# Altium project COOP4453_BerkantAy.PrjPcb
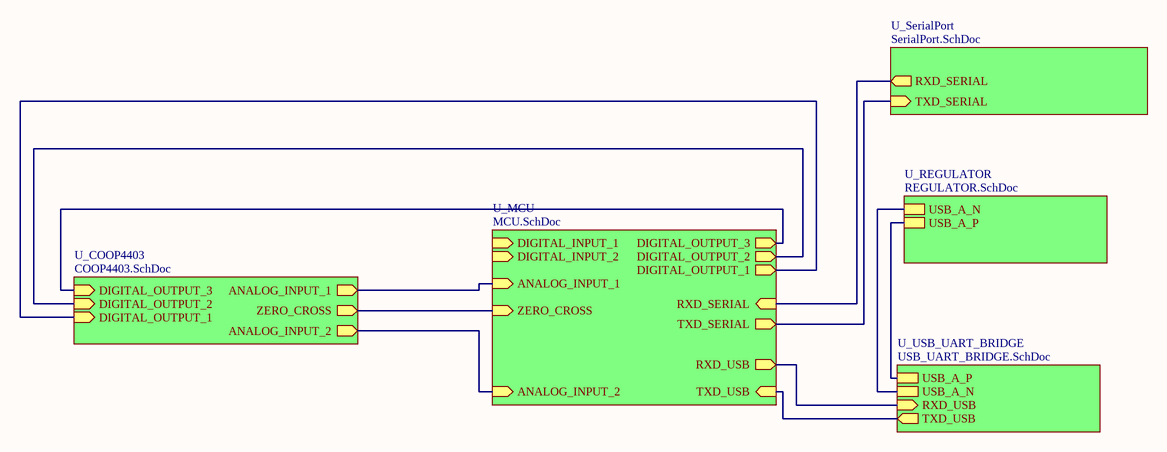
[diagram p0: MAINSCHEMATIC.SchDoc]
6 sheets, 104 parts. Net scope: hierarchical (ports join the sheet entries above them; power ports are global).
Board files: COOP4403_V2.PcbDoc, COOP4403.PcbDoc
Sheets:
  MAINSCHEMATIC.SchDoc
    U_COOP4403 = COOP4403.SchDoc
    U_MCU = MCU.SchDoc
    U_REGULATOR = REGULATOR.SchDoc
    U_SerialPort = SerialPort.SchDoc
    U_USB_UART_BRIDGE = USB_UART_BRIDGE.SchDoc

## Sheet MAINSCHEMATIC.SchDoc
size A

### Sub-sheets
U_COOP4403 = COOP4403.SchDoc: ANALOG_INPUT_2 (out), ANALOG_INPUT_1 (out), DIGITAL_OUTPUT_2 (in), DIGITAL_OUTPUT_1 (in), DIGITAL_OUTPUT_3 (in), ZERO_CROSS (out)
U_MCU = MCU.SchDoc: DIGITAL_OUTPUT_3 (out), DIGITAL_OUTPUT_2 (out), DIGITAL_OUTPUT_1 (out), DIGITAL_INPUT_1 (in), DIGITAL_INPUT_2 (in), RXD_USB (out), TXD_USB (in), ANALOG_INPUT_1 (in), ANALOG_INPUT_2 (in), ZERO_CROSS (in), TXD_SERIAL (out), RXD_SERIAL (in)
U_REGULATOR = REGULATOR.SchDoc: USB_A_N, USB_A_P
U_SerialPort = SerialPort.SchDoc: RXD_SERIAL (out), TXD_SERIAL (in)
U_USB_UART_BRIDGE = USB_UART_BRIDGE.SchDoc: USB_A_N, USB_A_P, TXD_USB (out), RXD_USB (in)

### Nets
RXD_A_N: sheet U_MCU/TXD_SERIAL, sheet U_SerialPort/TXD_SERIAL
RXD_A_P: sheet U_MCU/RXD_SERIAL, sheet U_SerialPort/RXD_SERIAL
USB_A_N: sheet U_REGULATOR/USB_A_N, sheet U_USB_UART_BRIDGE/USB_A_N
USB_A_P: sheet U_REGULATOR/USB_A_P, sheet U_USB_UART_BRIDGE/USB_A_P
USB_B_N: sheet U_MCU/TXD_USB, sheet U_USB_UART_BRIDGE/TXD_USB
USB_B_P: sheet U_MCU/RXD_USB, sheet U_USB_UART_BRIDGE/RXD_USB
NetC5_2: sheet U_COOP4403/ANALOG_INPUT_2, sheet U_MCU/ANALOG_INPUT_2
NetC7_2: sheet U_COOP4403/ANALOG_INPUT_1, sheet U_MCU/ANALOG_INPUT_1
NetIC2_1: sheet U_COOP4403/ZERO_CROSS, sheet U_MCU/ZERO_CROSS
NetIC4_9: sheet U_COOP4403/DIGITAL_OUTPUT_3, sheet U_MCU/DIGITAL_OUTPUT_3
NetIC4_10: sheet U_COOP4403/DIGITAL_OUTPUT_2, sheet U_MCU/DIGITAL_OUTPUT_2
NetIC4_11: sheet U_COOP4403/DIGITAL_OUTPUT_1, sheet U_MCU/DIGITAL_OUTPUT_1

## Sheet COOP4403.SchDoc
size A3
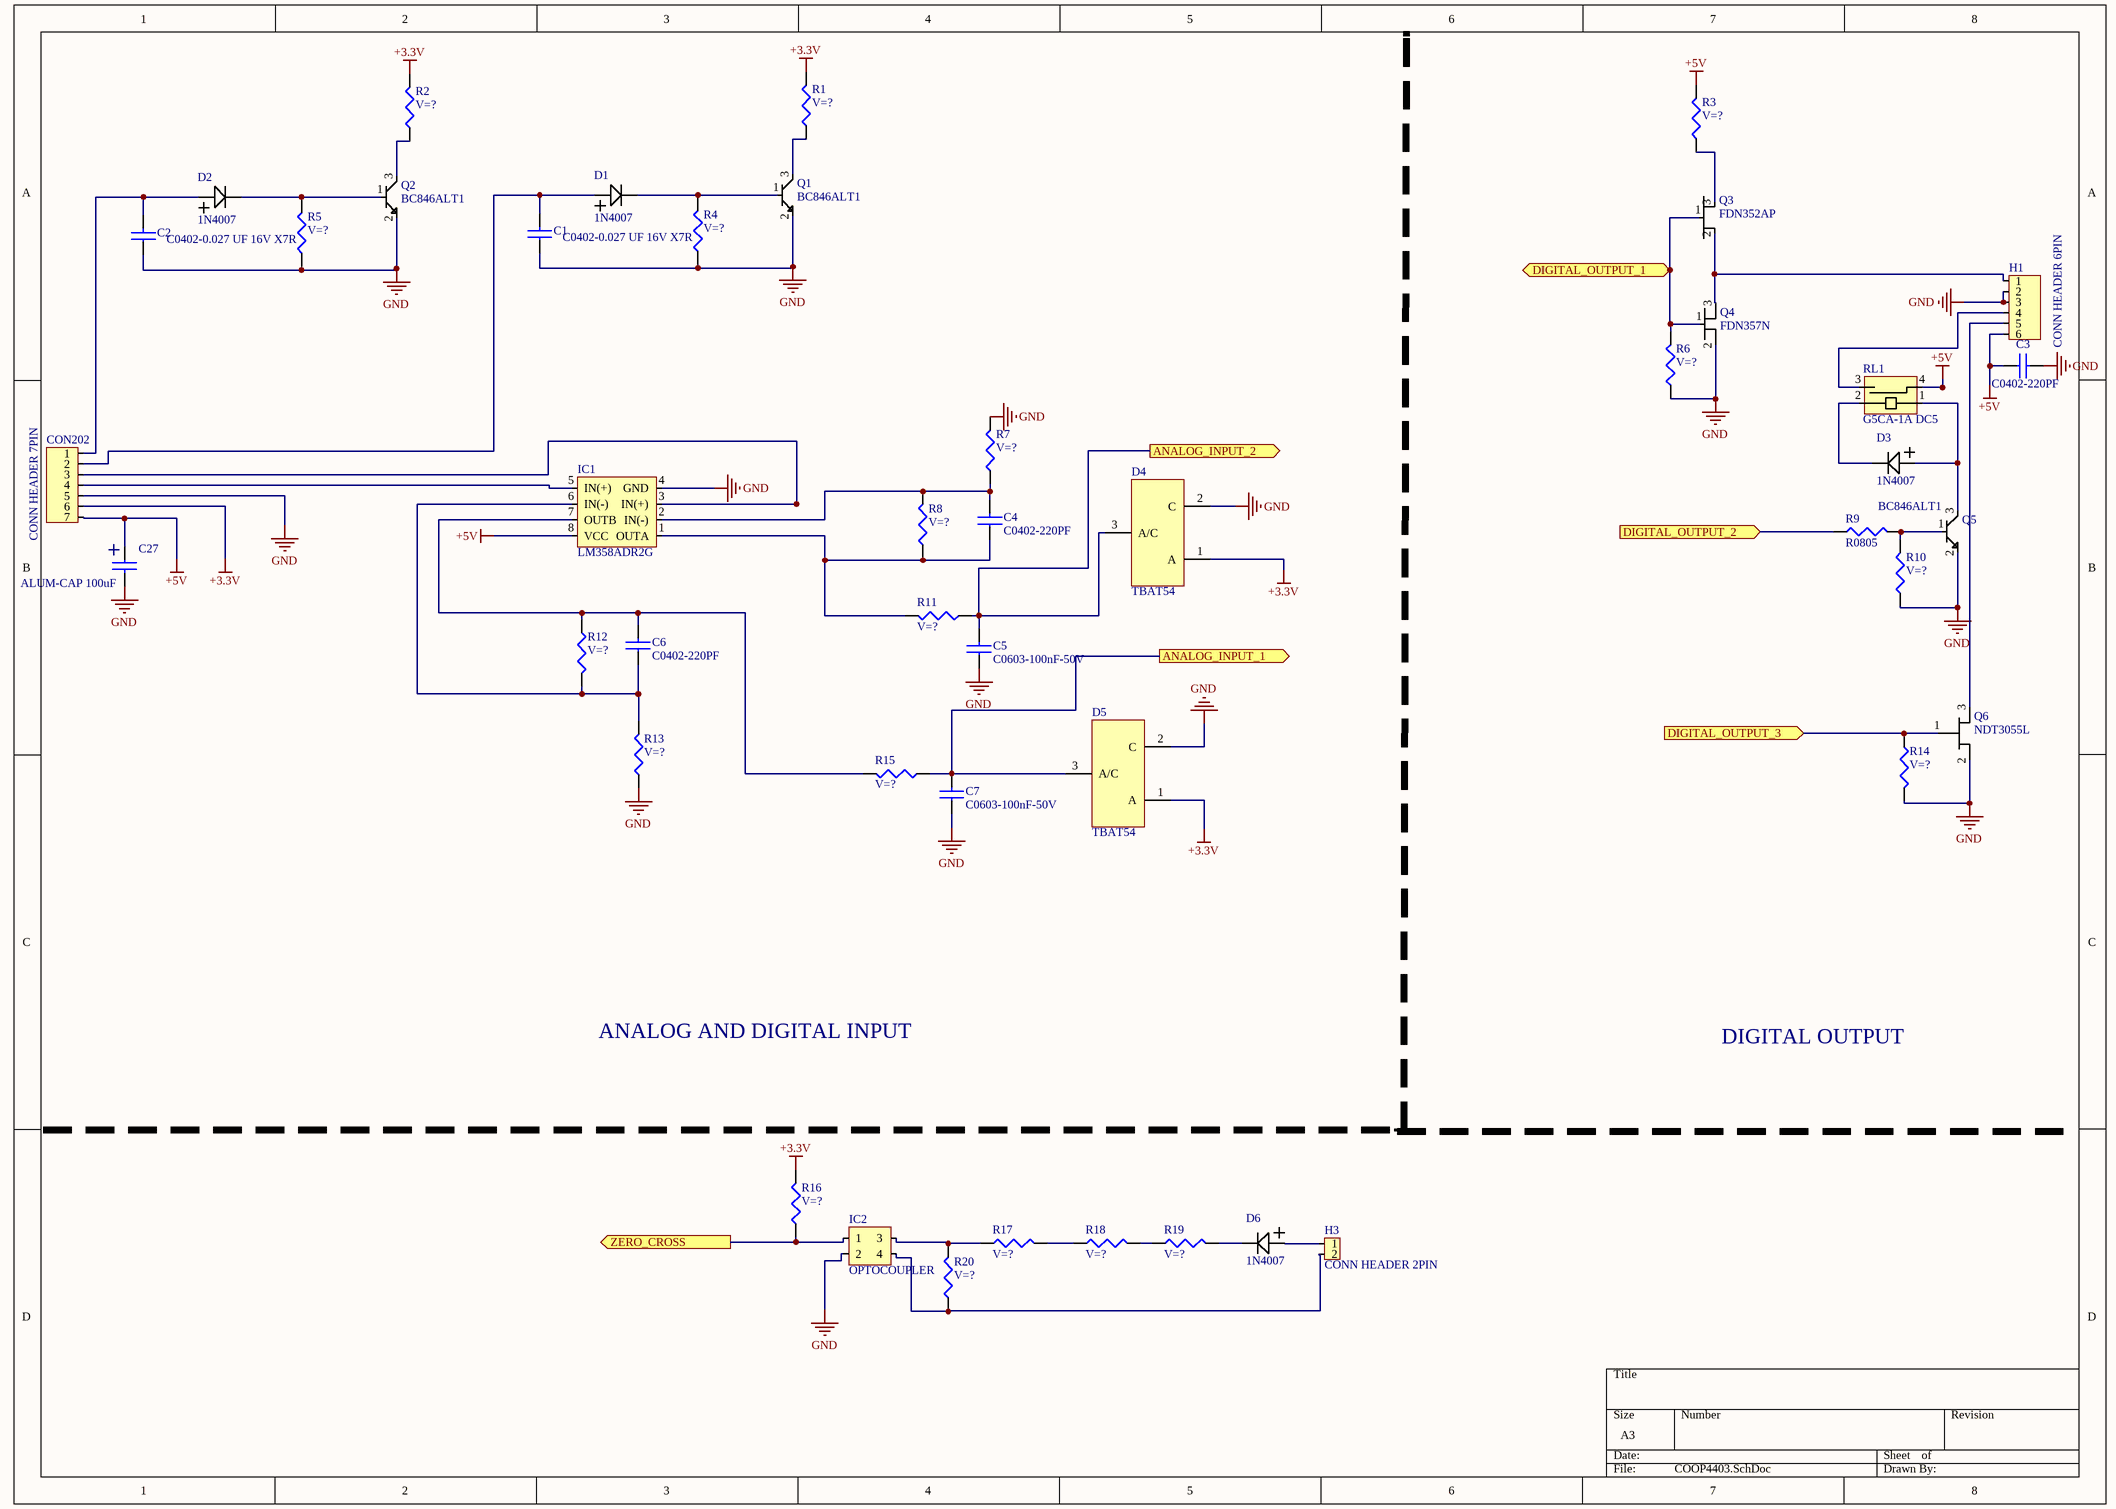
[diagram p1: COOP4403.SchDoc]

### Parts
C1  C0402-0.027 UF 16V X7R  [C0402]
C2  C0402-0.027 UF 16V X7R  [C0402]
C3  C0402-220PF  [C0402]
C4  C0402-220PF  [C0402]
C5  C0603-100nF-50V  [C0603]
C6  C0402-220PF  [C0402]
C7  C0603-100nF-50V  [C0603]
C27  ALUM-CAP 100uF  [ALUM-CAP]
CON202  CONN HEADER 7PIN  [CON HEADER 7PIN]
D1  1N4007  [sm4007]
D2  1N4007  [sm4007]
D3  1N4007  [sm4007]
D4  TBAT54  [SOT95P245X110-3N]
D5  TBAT54  [SOT95P245X110-3N]
D6  1N4007  [sm4007]
H1  CONN HEADER 6PIN  [CON HEADER 6PIN]
H3  CONN HEADER 2PIN  [CON HEADER 2PIN]
IC1  LM358ADR2G  [SOP127P700X380-8N]
IC2  OPTOCOUPLER  [4DIP_OPTO - duplicate]
Q1  BC846ALT1  [BC846ALT]
Q2  BC846ALT1  [BC846ALT]
Q3  FDN352AP  [FDN]
Q4  FDN357N  [FDN]
Q5  BC846ALT1  [BC846ALT]
Q6  NDT3055L  [realndt]
R1  V=?  [r0402]
R2  V=?  [r0402]
R3  V=?  [r0402]
R4  V=?  [R603]
R5  V=?  [R603]
R6  V=?  [R603]
R7  V=?  [r0402]
R8  V=?  [r0402]
R9  R0805  [R0805]
R10  V=?  [r0402]
R11  V=?  [r0402]
R12  V=?  [r0402]
R13  V=?  [r0402]
R14  V=?  [R603]
R15  V=?  [r0402]
R16  V=?  [r0402]
R17  V=?  [R1206]
R18  V=?  [R1206]
R19  V=?  [R1206]
R20  V=?  [R603]
RL1  G5CA-1A DC5  [RELAY OMRON]

### Ports
ANALOG_INPUT_1 (out), ANALOG_INPUT_2 (out), DIGITAL_OUTPUT_1 (in), DIGITAL_OUTPUT_2 (in), DIGITAL_OUTPUT_3 (in), ZERO_CROSS (out)

### Nets
+3.3V: CON202.6 D4.1(A) D5.1(A) R1.2 R2.2 R16.2
+5V: C3.1 C27.1 CON202.7 H1.6 IC1.8(VCC) R3.2 RL1.4
GND: C1.1 C2.1 C3.2 C5.1 C7.1 C27.2 CON202.5 D4.2(C) D5.2(C) H1.2 H1.3 IC1.4(GND) IC2.2 Q1.2 Q2.2 Q4.2 Q5.2 Q6.2 R4.1 R5.1 R6.1 R7.2 R10.1 R13.1 R14.2
NetC1_2: C1.2 CON202.2 D1.1
NetC2_2: C2.2 CON202.1 D2.1
NetC4_1: C4.1 IC1.1(OUTA) R8.1 R11.2
NetC4_2: C4.2 IC1.2(IN(-)) R7.1 R8.2
NetC5_2: C5.2 D4.3(A/C) R11.1 ; port ANALOG_INPUT_2
NetC6_1: C6.1 IC1.6(IN(-)) R12.2 R13.2
NetC6_2: C6.2 IC1.7(OUTB) R12.1 R15.2
NetC7_2: C7.2 D5.3(A/C) R15.1 ; port ANALOG_INPUT_1
NetCON202_3: CON202.3 IC1.3(IN(+))
NetCON202_4: CON202.4 IC1.5(IN(+))
NetD1_2: D1.2 Q1.1 R4.2
NetD2_2: D2.2 Q2.1 R5.2
NetD3_1: D3.1 Q5.3 RL1.1
NetD3_2: D3.2 RL1.2
NetD6_1: D6.1 H3.1
NetD6_2: D6.2 R19.2
NetH1_1: H1.1 Q3.2 Q4.3
NetH1_4: H1.4 RL1.3
NetH1_5: H1.5 Q6.3
NetH3_2: H3.2 IC2.4 R20.1
NetIC2_1: IC2.1 R16.1 ; port ZERO_CROSS
NetIC2_3: IC2.3 R17.1 R20.2
NetIC4_9: Q6.1 R14.1 ; port DIGITAL_OUTPUT_3
NetIC4_10: R9.1 ; port DIGITAL_OUTPUT_2
NetIC4_11: Q3.1 Q4.1 R6.2 ; port DIGITAL_OUTPUT_1
NetQ1_3: Q1.3 R1.1
NetQ2_3: Q2.3 R2.1
NetQ3_3: Q3.3 R3.1
NetQ5_1: Q5.1 R9.2 R10.2
NetR17_2: R17.2 R18.1
NetR18_2: R18.2 R19.1

### Notes on the sheet
- ANALOG AND DIGITAL INPUT
- DIGITAL OUTPUT

### Library data of the parts
C1 C2 = C0402-0.027 UF 16V X7R: CAP CER 0.027 UF 16V X7R
C3 C4 C6 = C0402-220PF: CAP CER 220PF 50V C0G/NP0 0402
C5 C7 = C0603-100nF-50V: CL10B104KB8NNNC
C27 = ALUM-CAP 100uF: CAP ALUM 100uF 20% 35V Radial
CON202 = CONN HEADER 7PIN: B7B-XHA
D1-D3 D6 = 1N4007: ONSEMI 1N4007
H1 = CONN HEADER 6PIN: B6B-XHA
H3 = CONN HEADER 2PIN: B2P-VHLFSN
Q1 Q2 Q5 = BC846ALT1: BJT TRANSISTOR NPN 65V 100MA
Q3 = FDN352AP: MOSFET SINGLE PCH TRENCH
Q4 = FDN357N: N CHANNEL LOGIC LEVEL ENGANCEMENT MODE FIELD EFFECT TRANSISTOR
Q6 = NDT3055L: N CHANNEL LOGIC LEVEL ENHANCEMENET MODE FIELD EFFECT TRANSISTOR
R1-R3 R7 R8 R10-R13 R15 R16 = R0402: RESISTOR
R4-R6 R14 R20 = R0603: CRCW06034R70FNEA
R17-R19 = R1206: ERJ-8ENF10R0V
RL1 = G5CA-1A DC5: RELAY GEN PURPOSES SPST 10A 5V

## Sheet MCU.SchDoc
size A3
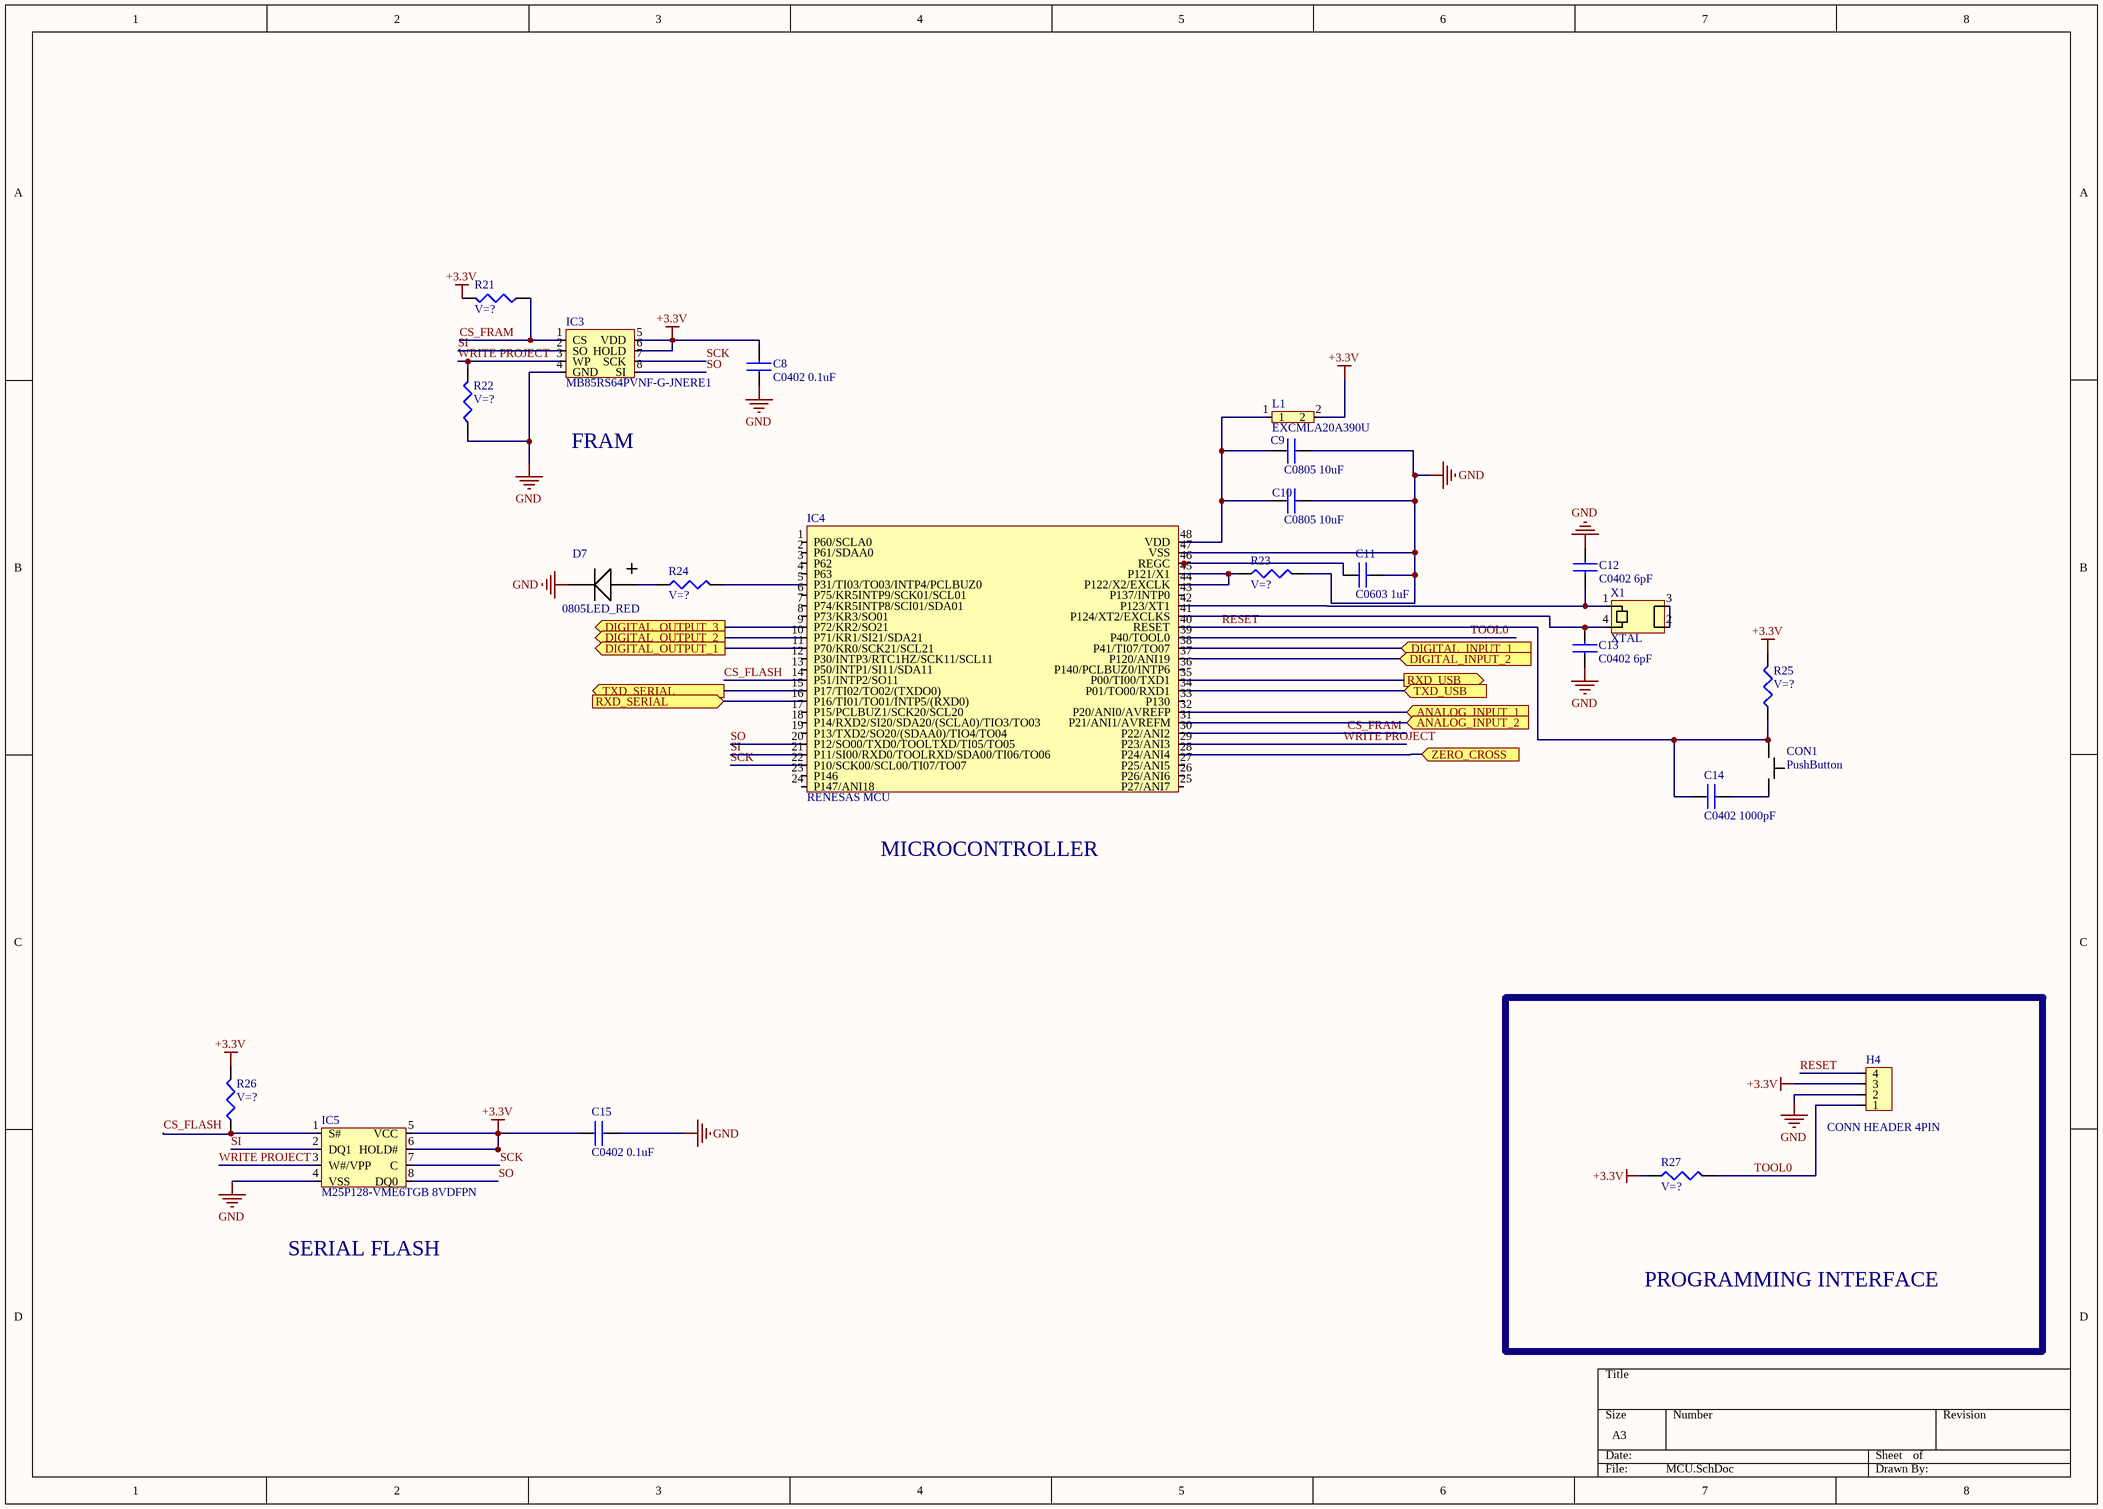
[diagram p2: MCU.SchDoc]

### Parts
C8  C0402 0.1uF  [C0402]
C9  C0805 10uF  [C0805]
C10  C0805 10uF  [C0805]
C11  C0603 1uF  [C0603]
C12  C0402 6pF  [C0402]
C13  C0402 6pF  [C0402]
C14  C0402 1000pF  [C0402]
C15  C0402 0.1uF  [C0402]
CON1  PushButton  [PUSHBUTTON]
D7  0805LED_RED  [0805LED_GREEN]
H4  CONN HEADER 4PIN  [CON HEADER 4PIN]
IC3  MB85RS64PVNF-G-JNERE1  [TSOP127P600X155-8N]
IC4  RENESAS MCU  [TSQFP50P900X900X160-48N]
IC5  M25P128-VME6TGB 8VDFPN  [QFN127P800X600X85_HS-9N]
L1  EXCMLA20A390U  [L0805]
R21  V=?  [r0402]
R22  V=?  [r0402]
R23  V=?  [r0402]
R24  V=?  [r0402]
R25  V=?  [r0402]
R26  V=?  [r0402]
R27  V=?  [r0402]
X1  XTAL  [XTAL]

### Blocks framed on the sheet
PROGRAMMING INTERFACE: H4 R27

### Ports
ANALOG_INPUT_1 (in), ANALOG_INPUT_2 (in), DIGITAL_INPUT_1 (in), DIGITAL_INPUT_2 (in), DIGITAL_OUTPUT_1 (out), DIGITAL_OUTPUT_2 (out), DIGITAL_OUTPUT_3 (out), RXD_SERIAL (in), RXD_USB (out), TXD_SERIAL (out), TXD_USB (in), ZERO_CROSS (in)

### Nets
+3.3V: C8.2 C15.1 H4.3 IC3.5(VDD) IC3.6(HOLD) IC5.5(VCC) IC5.6(HOLD#) L1.2 R21.2 R25.2 R26.2 R27.1
GND: C8.1 C9.2 C10.2 C11.2 C12.1 C13.1 C15.2 D7.1 H4.2 IC3.4(GND) IC4.47(VSS) IC5.4(VSS) R22.1 R23.2
CS_FLASH: IC4.14(P51/INTP2/SO11) IC5.1(S#) R26.1
CS_FRAM: IC3.1(CS) IC4.30(P22/ANI2) R21.1
RESET: C14.1 CON1.1 H4.4 IC4.40(RESET) R25.1
RXD_A_N: IC4.15(P17/TI02/TO02/(TXDO0)) ; port TXD_SERIAL
RXD_A_P: IC4.16(P16/TI01/TO01/INTP5/(RXD0)) ; port RXD_SERIAL
SCK: IC3.7(SCK) IC4.22(P10/SCK00/SCL00/TI07/TO07) IC5.7(C)
SI: IC3.2(SO) IC4.21(P11/SI00/RXD0/TOOLRXD/SDA00/TI06/TO06) IC5.2(DQ1)
SO: IC3.8(SI) IC4.20(P12/SO00/TXD0/TOOLTXD/TI05/TO05) IC5.8(DQ0)
TOOL0: H4.1 IC4.39(P40/TOOL0) R27.2
USB_B_N: IC4.34(P01/TO00/RXD1) ; port TXD_USB
USB_B_P: IC4.35(P00/TI00/TXD1) ; port RXD_USB
WRITE PROJECT: IC3.3(WP) IC4.29(P23/ANI3) IC5.3(W#/VPP) R22.2
NetC5_2: IC4.31(P21/ANI1/AVREFM) ; port ANALOG_INPUT_2
NetC7_2: IC4.32(P20/ANI0/AVREFP) ; port ANALOG_INPUT_1
NetC9_1: C9.1 C10.1 IC4.48(VDD) L1.1
NetC11_1: C11.1 IC4.46(REGC)
NetC12_2: C12.2 IC4.42(P123/XT1) X1.1
NetC13_2: C13.2 IC4.41(P124/XT2/EXCLKS) X1.4
NetC14_2: C14.2 CON1.2
NetD7_2: D7.2 R24.1
NetIC2_1: IC4.28(P24/ANI4) ; port ZERO_CROSS
NetIC4_5: IC4.5(P31/TI03/TO03/INTP4/PCLBUZ0) R24.2
NetIC4_9: IC4.9(P72/KR2/SO21) ; port DIGITAL_OUTPUT_3
NetIC4_10: IC4.10(P71/KR1/SI21/SDA21) ; port DIGITAL_OUTPUT_2
NetIC4_11: IC4.11(P70/KR0/SCK21/SCL21) ; port DIGITAL_OUTPUT_1
NetIC4_37: IC4.37(P120/ANI19) ; port DIGITAL_INPUT_2
NetIC4_38: IC4.38(P41/TI07/TO07) ; port DIGITAL_INPUT_1
NetIC4_44: IC4.44(P122/X2/EXCLK) IC4.45(P121/X1) R23.1
NetX1_2: X1.2 X1.3

Not connected (* = marked no-connect by the designer): IC4 1(P60/SCLA0) 2(P61/SDAA0) 3(P62) 4(P63) 6(P75/KR5INTP9/SCK01/SCL01) 7(P74/KR5INTP8/SCI01/SDA01) 8(P73/KR3/SO01) 12(P30/INTP3/RTC1HZ/SCK11/SCL11) 13(P50/INTP1/SI11/SDA11) 17(P15/PCLBUZ1/SCK20/SCL20) 18(P14/RXD2/SI20/SDA20/(SCLA0)/TIO3/TO03) 19(P13/TXD2/SO20/(SDAA0)/TIO4/TO04) 23(P146) 24(P147/ANI18) 25(P27/ANI7) 26(P26/ANI6) 27(P25/ANI5) 33(P130) 36(P140/PCLBUZ0/INTP6) 43(P137/INTP0)

### Notes on the sheet
- FRAM
- (near IC4) MICROCONTROLLER
- SERIAL FLASH

### Library data of the parts
C8 C15 = C0402 0.1uF: CAP CER 0.1uF 16V X7R 0402 / SAMSUNG
C9 C10 = C0805 10uF: CAP CER 10uF 6.3V X7R 0805 / C0805C106K9RACTU
C11 = C0603 1uF: CAP CER 1uF 10V X7R 0603
C12 C13 = C0402 6pF: CAP CER 6pF 100V C0G/NP0 0402 / KEMET
C14 = C0402 1000pF: CAP CER 1000pF 26V X7R 0402 / CL05B102KA5NNNC
CON1 = PushButton: SKPDACD010
D7 = 0805LED_RED: LSR976
H4 = CONN HEADER 4PIN: B4B-XHALFSN
IC3 = MB85RS64PVNF-G-JNERE1: IC FRAM 64K SPI 20MHZ 8SOP
IC4 = RENESAS MCU: IC MCU 16BIT 32KB FLASH 48LQFP
IC5 = M25P128-VME6TGB 8VDFPN: IC FLASH 128M SPI 54MHZ 9VDFPN
L1 = EXCMLA20A390U: FERRITE BEAD 39 OHM
R21-R27 = R0402: RESISTOR
X1 = XTAL: SSP-T7-F

## Sheet REGULATOR.SchDoc
size A3
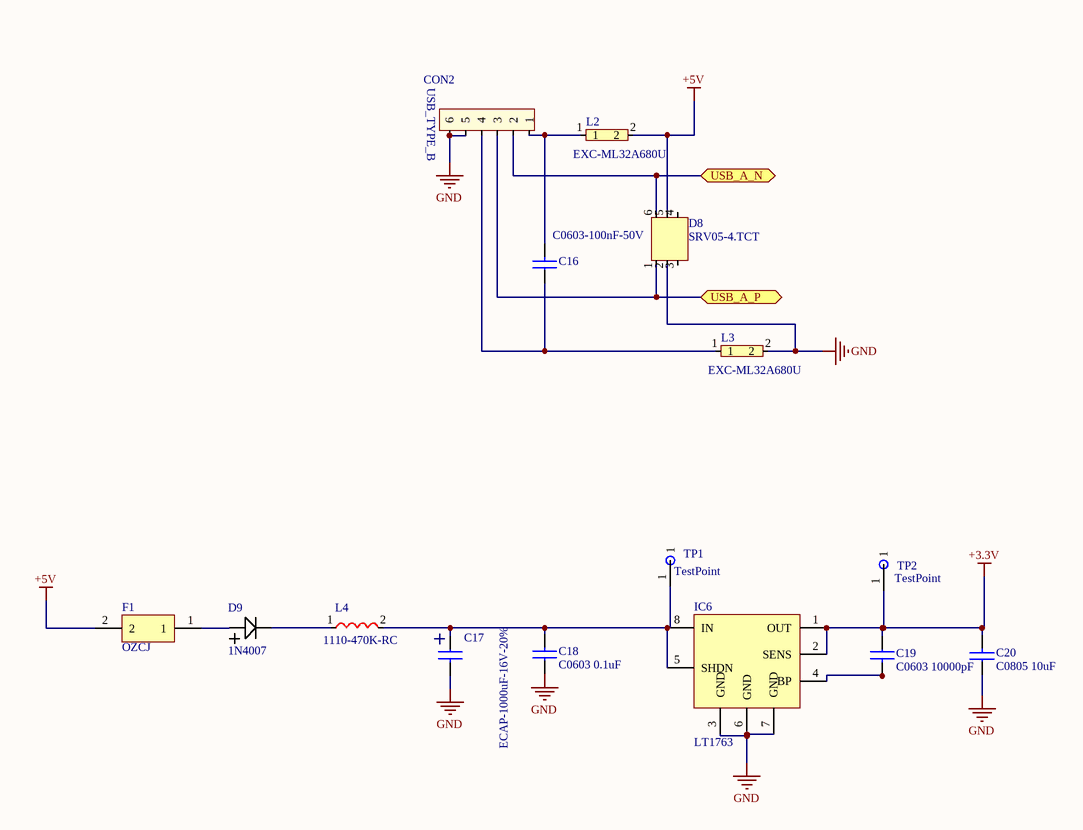
[diagram p3: REGULATOR.SchDoc]

### Parts
C16  C0603-100nF-50V  [C0603]
C17  ECAP-1000uF-16V-20%  [CAP_SMT]
C18  C0603 0.1uF  [C0603]
C19  C0603 10000pF  [C0603]
C20  C0805 10uF  [C0805]
CON2  (no value)  [CON_670688000]
D8  SRV05-4.TCT  [SOT23]
D9  1N4007  [1N4007]
F1  OZCJ  [OZCJ]
IC6  LT1763  [SOIC127P600X170-8N]
L2  EXC-ML32A680U  [L1608]
L3  EXC-ML32A680U  [L1608]
L4  1110-470K-RC  [1110 Coil]
TP1  TestPoint  [TestPoint]
TP2  TestPoint  [TestPoint]

### Ports
USB_A_N, USB_A_P

### Nets
+3.3V: C19.1 C20.2 IC6.1(OUT) IC6.2(SENS) TP2.1
+5V: D8.5 F1.2 L2.2
GND: C17.2 C18.1 C20.1 CON2.5 CON2.6 D8.2 IC6.3(GND) IC6.6(GND) IC6.7(GND) L3.2
USB_A_N: CON2.2 D8.6 ; port USB_A_N
USB_A_P: CON2.3 D8.1 ; port USB_A_P
NetC16_1: C16.1 CON2.4 L3.1
NetC16_2: C16.2 CON2.1 L2.1
NetC17_1: C17.1 C18.2 IC6.5(SHDN) IC6.8(IN) L4.2 TP1.1
NetC19_2: C19.2 IC6.4(BP)
NetD9_1: D9.1 F1.1
NetD9_2: D9.2 L4.1

Not connected (* = marked no-connect by the designer): D8 3 4

### Notes on the sheet
- (in symbol 670688000) USB_TYPE_B

### Library data of the parts
C16 = C0603-100nF-50V: CL10B104KB8NNNC
C17 = ECAP-1000uF-16V-20%: CAP ALUM 1000pF 20% 16V / UCL1C102MNL1GS
C18 = C0603 0.1uF: CAP CER 0.1uF 16V X7R 0603 / CL10B104K08NNNC
C19 = C0603 10000pF: CAP CER 10000pF 25V 10% X7R 0603 / CL10B103KA8NNNC
C20 = C0805 10uF: as C9 on sheet MCU
CON2 = 670688000: CONN USB RT ANG RECPT TYPE B BLK
D8 = SRV05-4.TCT: TVS DIODE 5V 17.5V DIODE SOT23-6
D9 = 1N4007: ONSEMI 1N4007
L2 L3 = EXC-ML32A680U: FERRITE BEAD 68 OHM 1206
L4 = 1110-470K-RC: FIXED IND 47UH 2.8A 62MOHM TH

## Sheet SerialPort.SchDoc
size A
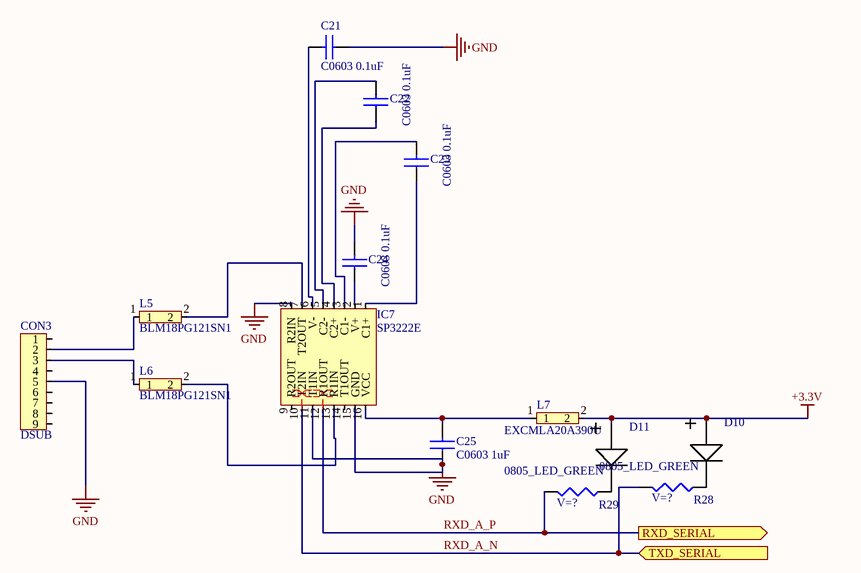
[diagram p4: SerialPort.SchDoc]

### Parts
C21  C0603 0.1uF  [C0603]
C22  C0603 0.1uF  [C0603]
C23  C0603 0.1uF  [C0603]
C24  C0603 0.1uF  [C0603]
C25  C0603 1uF  [C0603]
CON3  DSUB  [DSUB]
D10  0805_LED_GREEN  [0805LED_GREEN]
D11  0805_LED_GREEN  [0805LED_GREEN]
IC7  SP3222E  [SSOP16]
L5  BLM18PG121SN1  [C0603]
L6  BLM18PG121SN1  [C0603]
L7  EXCMLA20A390U  [L0805]
R28  V=?  [r0402]
R29  V=?  [r0402]

### Ports
RXD_SERIAL (out), TXD_SERIAL (in)

### Nets
+3.3V: D10.2 D11.2 L7.2
GND: C21.1 C24.2 C25.1 CON3.5 IC7.8(R2IN) IC7.11(T1IN) IC7.15(GND)
RXD_A_N: IC7.10(T2IN) R28.2 ; port TXD_SERIAL
RXD_A_P: IC7.12(R1OUT) R29.2 ; port RXD_SERIAL
NetC21_2: C21.2 IC7.6(V-)
NetC22_1: C22.1 IC7.4(C2+)
NetC22_2: C22.2 IC7.5(C2-)
NetC23_1: C23.1 IC7.1(C1+)
NetC23_2: C23.2 IC7.3(C1-)
NetC24_1: C24.1 IC7.2(V+)
NetC25_2: C25.2 IC7.16(VCC) L7.1
NetCON3_2: CON3.2 L5.1
NetCON3_3: CON3.3 L6.1
NetD10_1: D10.1 R28.1
NetD11_1: D11.1 R29.1
NetIC7_7: IC7.7(T2OUT) L5.2
NetIC7_13: IC7.13(R1IN) L6.2

Not connected (* = marked no-connect by the designer): CON3 1 4 6 7 8 9; IC7 9(R2OUT) 14(T1OUT)

### Layout directives
differential pair; rule Differential Pairs Routing [Pref Gap = 6mil    Min Gap  = 6mil    Max Gap  = 6milPref Width = 9.5mil    Min Width  = 9.5mil    Max Width  = 9.5mil]: RXD_A_N, RXD_A_P

### Library data of the parts
C21-C24 = C0603 0.1uF: as C18 on sheet REGULATOR
C25 = C0603 1uF: CAP CER 1uF 10V X7R 0603
CON3 = DSUB: 1734354 - DSUB
D10 D11 = 0805_LED_GREEN: LGR971-KN OSRAM
IC7 = SP3222E: IC TXRX RS232 ESD TRUE 16SSOP
L5 L6 = BLM18PG121SN1: FERRITE BEAD 120OHM 2A
L7 = EXCMLA20A390U: FERRITE BEAD 39 OHM
R28 R29 = R0402: RESISTOR

## Sheet USB_UART_BRIDGE.SchDoc
size A
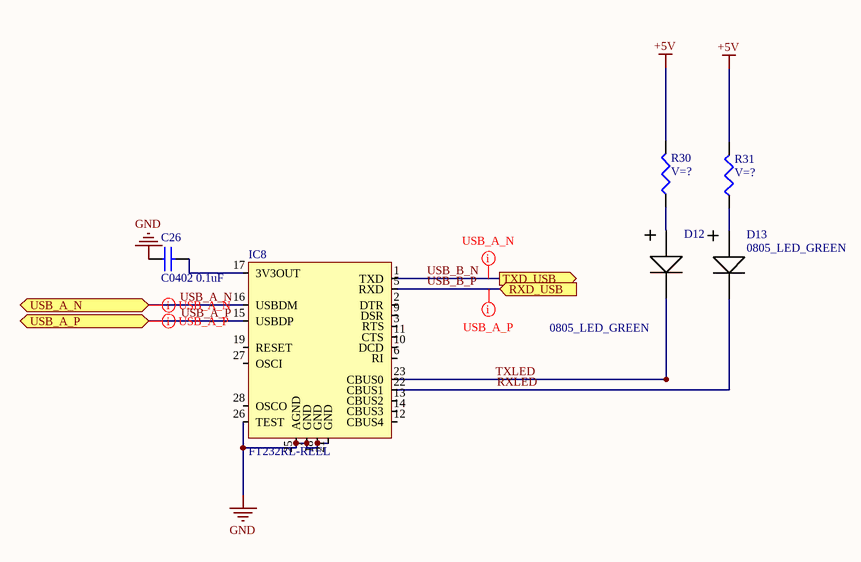
[diagram p5: USB_UART_BRIDGE.SchDoc]

### Parts
C26  C0402 0.1uF  [C0402]
D12  0805_LED_GREEN  [0805LED_GREEN]
D13  0805_LED_GREEN  [0805LED_GREEN]
IC8  FT232RL-REEL  [SSOP28]
R30  V=?  [r0402]
R31  V=?  [r0402]

### Ports
RXD_USB (in), TXD_USB (out), USB_A_N, USB_A_P

### Nets
+5V: R30.2 R31.2
GND: C26.1 IC8.7(GND) IC8.18(GND) IC8.21(GND) IC8.25(AGND) IC8.26(TEST)
RXLED: D13.1 IC8.22(CBUS1)
TXLED: D12.1 IC8.23(CBUS0)
USB_A_N: IC8.16(USBDM) ; port USB_A_N
USB_A_P: IC8.15(USBDP) ; port USB_A_P
USB_B_N: IC8.1(TXD) ; port TXD_USB
USB_B_P: IC8.5(RXD) ; port RXD_USB
NetC26_2: C26.2 IC8.17(3V3OUT)
NetD12_2: D12.2 R30.1
NetD13_2: D13.2 R31.1

Not connected (* = marked no-connect by the designer): IC8 2(DTR) 3(RTS) 6(RI) 9(DSR) 10(DCD) 11(CTS) 12(CBUS4) 13(CBUS2) 14(CBUS3) 19(RESET) 27(OSCI) 28(OSCO)

### Layout directives
differential pair; rule Differential Pairs Routing [Pref Gap = 6mil    Min Gap  = 6mil    Max Gap  = 6milPref Width = 9.5mil    Min Width  = 9.5mil    Max Width  = 9.5mil]; rule Differential Pairs Routing [Pref Gap = 6mil    Min Gap  = 6mil    Max Gap  = 6milPref Width = 9.5mil    Min Width  = 9.5mil    Max Width  = 9.5mil]: USB_A_N
differential pair; rule Differential Pairs Routing [Pref Gap = 6mil    Min Gap  = 6mil    Max Gap  = 6milPref Width = 9.5mil    Min Width  = 9.5mil    Max Width  = 9.5mil]; rule Differential Pairs Routing [Pref Gap = 6mil    Min Gap  = 6mil    Max Gap  = 6milPref Width = 9.5mil    Min Width  = 9.5mil    Max Width  = 9.5mil]; rule Differential Pairs Routing [Pref Gap = 6mil    Min Gap  = 6mil    Max Gap  = 6milPref Width = 9.5mil    Min Width  = 9.5mil    Max Width  = 9.5mil]: USB_A_P
differential pair; rule Differential Pairs Routing [Pref Gap = 6mil    Min Gap  = 6mil    Max Gap  = 6milPref Width = 9.5mil    Min Width  = 9.5mil    Max Width  = 9.5mil]: USB_B_N, USB_B_P

### Library data of the parts
C26 = C0402 0.1uF: CAP CER 0.1uF 16V X7R 0402 / SAMSUNG
D12 D13 = 0805_LED_GREEN: LGR971-KN OSRAM
IC8 = FT232RL-REEL: IC USB FS SERIAL UART 28-SSOP
R30 R31 = R0402: RESISTOR

## Nets that join several sheets
+3.3V: COOP4403 (6 pins), MCU (12 pins), REGULATOR (5 pins), SerialPort (D10.2 D11.2 L7.2)
+5V: COOP4403 (7 pins), REGULATOR (D8.5 F1.2 L2.2), USB_UART_BRIDGE (R30.2 R31.2)
GND: COOP4403 (25 pins), MCU (14 pins), REGULATOR (10 pins), SerialPort (7 pins), USB_UART_BRIDGE (6 pins)
NetC5_2: COOP4403 (C5.2 D4.3 R11.1), MCU (IC4.31)
NetC7_2: COOP4403 (C7.2 D5.3 R15.1), MCU (IC4.32)
NetIC2_1: COOP4403 (IC2.1 R16.1), MCU (IC4.28)
NetIC4_9: COOP4403 (Q6.1 R14.1), MCU (IC4.9)
NetIC4_10: COOP4403 (R9.1), MCU (IC4.10)
NetIC4_11: COOP4403 (Q3.1 Q4.1 R6.2), MCU (IC4.11)
RXD_A_N: MCU (IC4.15), SerialPort (IC7.10 R28.2)
RXD_A_P: MCU (IC4.16), SerialPort (IC7.12 R29.2)
USB_A_N: REGULATOR (CON2.2 D8.6), USB_UART_BRIDGE (IC8.16)
USB_A_P: REGULATOR (CON2.3 D8.1), USB_UART_BRIDGE (IC8.15)
USB_B_N: MCU (IC4.34), USB_UART_BRIDGE (IC8.1)
USB_B_P: MCU (IC4.35), USB_UART_BRIDGE (IC8.5)